# Altium project Extender_PCB.PrjPcb
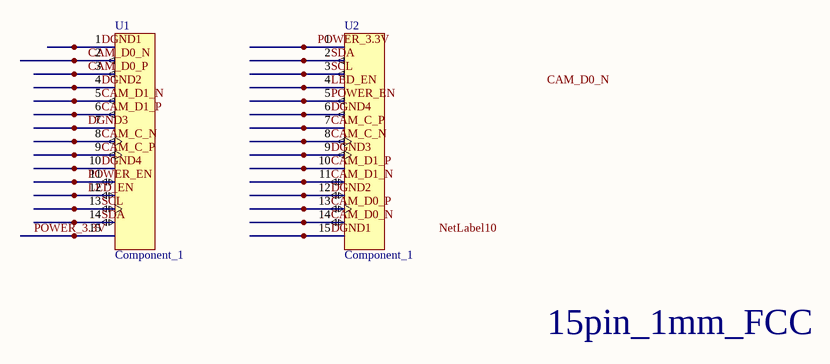
[diagram p0: 15pin_1mm_FPC.SchDoc]
1 sheet, 2 parts. Net scope: global (net labels, ports and power ports of the same name join across sheets).
Board files: PCB1.PcbDoc, PCB2.PcbDoc

## Sheet 15pin_1mm_FPC.SchDoc
size A; SheetNumber: 1; SheetTotal: 1

### Parts
U1  Component_1  [15pin_1mm_FPC]
U2  Component_1  [15pin_1mm_FPC]

### Nets
CAM_C_N: U1.8 U2.8
CAM_C_P: U1.9 U2.7
CAM_D0_N: U1.2 U2.14
CAM_D0_P: U1.3 U2.13
CAM_D1_N: U1.5 U2.11
CAM_D1_P: U1.6 U2.10
DGND1: U1.1 U2.15
DGND2: U1.4 U2.12
DGND3: U1.7 U2.9
DGND4: U1.10 U2.6
LED_EN: U1.12 U2.4
POWER_3.3V: U1.15 U2.1
POWER_EN: U1.11 U2.5
SCL: U1.13 U2.3
SDA: U1.14 U2.2

### Notes on the sheet
- 15pin_1mm_FCC
- Labels drawn without touching a wire or pin: CAM_D0_N, NetLabel10